# Altium schematic sheet STM32_microcontroller_power.SchDoc: STM32_microcontroller_power
size A4; Date: Not used; ApprovedBy: Not used; CheckedBy: Not used; Author: Not used; CompanyName: STMicroelectronics; DrawnBy: Not used; Engineer: Not used; Organization: Not used; Address1: Not used; Address2: Not used; Address3: Not used; Address4: Not used; DocumentNumber: 4; Revision: Not used; SheetNumber: 4; SheetTotal: 9; CurrentTime: Not used; CurrentDate: Not used; Time: Not used; DocumentFullPathAndName: Not used; DocumentName: Not used; ModifiedDate: Not used; ImagePath: Not used; ProjectName: Not used; Application_BuildNumber: Not used
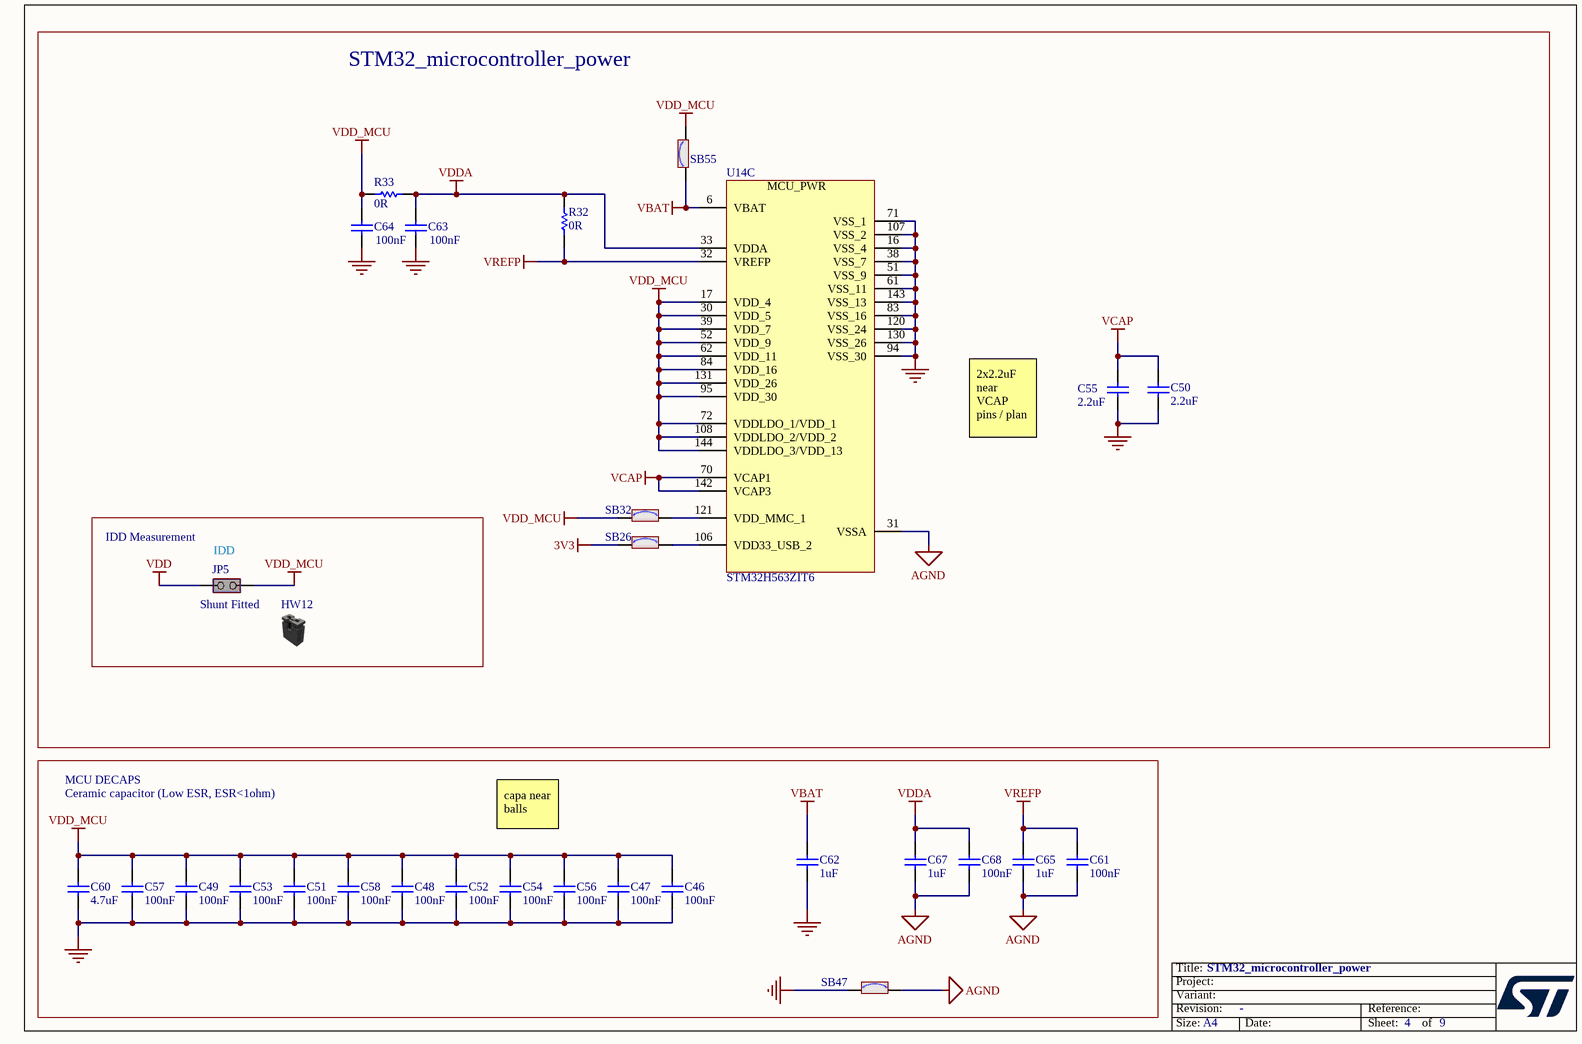
[diagram p0: STM32_microcontroller_power.SchDoc]

## Parts
C46  value 100nF  [C0402]  (hidden comment: Capacitor)
C47  value 100nF  [C0402]  (hidden comment: Capacitor)
C48  value 100nF  [C0402]  (hidden comment: Capacitor)
C49  value 100nF  [C0402]  (hidden comment: Capacitor)
C50  value 2.2uF  [C0603]  (hidden comment: Capacitor)
C51  value 100nF  [C0402]  (hidden comment: Capacitor)
C52  value 100nF  [C0402]  (hidden comment: Capacitor)
C53  value 100nF  [C0402]  (hidden comment: Capacitor)
C54  value 100nF  [C0402]  (hidden comment: Capacitor)
C55  value 2.2uF  [C0603]  (hidden comment: Capacitor)
C56  value 100nF  [C0402]  (hidden comment: Capacitor)
C57  value 100nF  [C0402]  (hidden comment: Capacitor)
C58  value 100nF  [C0402]  (hidden comment: Capacitor)
C60  value 4.7uF  [C0603_H0P8]  (hidden comment: Capacitor)
C61  value 100nF  [C0402]  (hidden comment: Capacitor)
C62  value 1uF  [C0603]  (hidden comment: Capacitor)
C63  value 100nF  [C0402]  (hidden comment: Capacitor)
C64  value 100nF  [C0402]  (hidden comment: Capacitor)
C65  value 1uF  [C0603]  (hidden comment: Capacitor)
C67  value 1uF  [C0603]  (hidden comment: Capacitor)
C68  value 100nF  [C0402]  (hidden comment: Capacitor)
HW12  Shunt Black 2.54mm  (value not drawn)  (mechanical)
JP5  value Shunt Fitted  [CON_SAMTEC_TSW-102-07-G-S]  (hidden comment: Jumper_Header 2x1 Fitted)
R32  value 0R  [R0603]  (hidden comment: Resistor)
R33  value 0R  [R0603]  (hidden comment: Resistor)
SB26  SB_ON  [SOLDER-BRIDGE_R0402-0R]  (value not drawn)
SB32  SB_ON  [SOLDER-BRIDGE_R0603-0R]  (value not drawn)
SB47  SB_ON  [SOLDER-BRIDGE_R0603-0R]  (value not drawn)
SB55  SB_ON  [SOLDER-BRIDGE_R0402-0R]  (value not drawn)
U14  STM32H563ZIT6  [ICC_LQFP144_20X20_P050_SOCKET_YAMAICHI_IC149-144-145-B5_NM]  (part C of 3)

## Blocks framed on the sheet
STM32_microcontroller_power: C50 C55 C63 C64 HW12 JP5 R32 R33 SB26 SB32 SB55 U14

## Nets
3V3: SB26.1
AGND: C61.1 C65.2 C67.2 C68.1 SB47.2 U14.31(VSSA)
GND: C46.1 C47.1 C48.1 C49.1 C50.1 C51.1 C52.1 C53.1 C54.1 C55.1 C56.1 C57.1 C58.1 C60.1 C62.1 C63.2 C64.2 SB47.1 U14.16(VSS_4) U14.38(VSS_7) U14.51(VSS_9) U14.61(VSS_11) U14.71(VSS_1) U14.83(VSS_16) U14.94(VSS_30) U14.107(VSS_2) U14.120(VSS_24) U14.130(VSS_26) U14.143(VSS_13)
VBAT: C62.2 SB55.1 U14.6(VBAT)
VCAP: C50.2 C55.2 U14.70(VCAP1) U14.142(VCAP3)
VDD: JP5.1(COMMON)
VDD_MCU: C46.2 C47.2 C48.2 C49.2 C51.2 C52.2 C53.2 C54.2 C56.2 C57.2 C58.2 C60.2 C64.1 JP5.2(NO) R33.1 SB32.1 SB55.2 U14.17(VDD_4) U14.30(VDD_5) U14.39(VDD_7) U14.52(VDD_9) U14.62(VDD_11) U14.72(VDDLDO_1/VDD_1) U14.84(VDD_16) U14.95(VDD_30) U14.108(VDDLDO_2/VDD_2) U14.131(VDD_26) U14.144(VDDLDO_3/VDD_13)
VDDA: C63.1 C67.1 C68.2 R32.1 R33.2 U14.33(VDDA)
VREFP: C61.2 C65.1 R32.2 U14.32(VREFP)
NetSB26_2: SB26.2 U14.106(VDD33_USB_2)
NetSB32_2: SB32.2 U14.121(VDD_MMC_1)

## Notes on the sheet
- 2x2.2uF near VCAP pins / plan
- (near JP5) IDD Measurement
- (near JP5) IDD
- MCU DECAPS
- Ceramic capacitor (Low ESR, ESR<1ohm)
- capa near balls
- Title:
- Project:
- Size:
- Revision:
- Variant:
- A4
- -
- Date:
- Reference:
- Sheet:
- of
- (in symbol MCD-02359, part C) MCU_PWR

## Library data of the parts
C46-C49 C51-C54 C56-C58 C61 C68 = MCD-00006: Capacitor, MLCC, 100nF, 16V, X7R, +/-10%, 0402, T=0.5mm; Part_Preference: Recommended; Manufacturer: YAGEO; Manufacturer_Part_Number: CC0402KRX7R7BB104; Alternate_Manufacturer: MURATA; Alternate_Manufacturer_Part_Number: GCM155R71C104KA55D; Order_Code_RS: 616-9701; Internal_Part_Number: MCD-00006; Status: Released; Part_Type: Capacitor; Package: 0402; ComponentLink1URL: http://tunmcdsvn.tun.st.com/Component_Documentation_Library/Trunk/Capacitor/YAGEO_X7R_Series; Order_Code_Digikey: 311-1338-1-ND; Order_Code_Farnell: 9402047
C50 C55 = MCD-00012: Capacitor, MLCC, 2.2uF, 10V, X5R, 10%, 0603, T=0,8mm; Manufacturer_Part_Number: CC0603KRX5R6BB225; Manufacturer: YAGEO; Alternate_Manufacturer_Part_Number: C0603C225K8PACTU; Alternate_Manufacturer: KEMET; Provided_By: SUBCO; ECCN_US: EAR99; ECCN_EU: NEC; Internal_Part_Number: MCD-00012; Status: Released; Part_Type: Capacitor; Package: C0603; ComponentLink1Description: Datasheet; ComponentLink1URL: http://tunmcdsvn.tun.st.com/Component_Datasheet_Library/Trunk/Capacitors/Yageo_Multilayer_capacitor_X5R_series_100pF_to_100uF
C60 = MCD-03342: Capacitor, MLCC, 4.7uF, 10V, X5R, +/-20%, 0603, T=0.8mm; Part_Preference: Recommended; Manufacturer: YAGEO; Manufacturer_Part_Number: CC0603MRX5R6BB475; Component_Country_Of_Origin: China, Taiwan; ShowFields: YES; ID: 5458; Internal_Part_Number: MCD-03342; Status: Checked; Part_Type: Capacitor; Package: 0603; ComponentLink1URL: http://tunmcdsvn.tun.st.com/Component_Documentation_Library/Trunk/Capacitor/YAGEO_X5R_Series/; Order_Code_Digikey: 311-1820-2-ND; Order_Code_Farnell: 3369257; Order_Code_RS: N/A
C62 C65 C67 = MCD-00238: Capacitor, MLCC, 1uF, 6V3, X5R, 10%, 0603, T=0,8mm; Manufacturer_Part_Number: CC0603KRX5R5BB105; Manufacturer: YAGEO; Provided_By: SUBCO; ECCN_US: EAR99; ECCN_EU: NEC; Internal_Part_Number: MCD-00238; Status: Released; Part_Type: Capacitor; Package: C0603; ComponentLink1Description: Datasheet; ComponentLink1URL: http://tunmcdsvn.tun.st.com/Component_Datasheet_Library/Trunk/Capacitors/Yageo_Multilayer_capacitor_X5R_series_100pF_to_100uF
C63 C64 = MCD-00006: Capacitor, MLCC, 100nF, 16V, X7R, 10%, 0402, T=0.5mm; Manufacturer_Part_Number: CC0402KRX7R7BB104; Manufacturer: YAGEO; Alternate_Manufacturer_Part_Number: GCM155R71C104KA55D; Alternate_Manufacturer: MURATA; Provided_By: SUBCO; ECCN_US: EAR99; ECCN_EU: NEC; Internal_Part_Number: MCD-00006; ComponentLink1Description: Datasheet; Status: Released; Package: C0402; Part_Type: Capacitor; ComponentLink1URL: http://tunmcdsvn.tun.st.com/Component_Datasheet_Library/Trunk/Capacitors/Yageo_Multilayer_Capacitor_X7R_series_100pF_to_22uF
HW12 = MCD-00043: SHUNT 2.54mm BLACK; Manufacturer_Part_Number: SNT-100-BK-G; Manufacturer: SAMTEC; Part_Type: Mechanical; Alternate_Manufacturer_Part_Number: 316102S111A; Alternate_Manufacturer: JIUBABA; Provided_By: SUBCO; Value: SNT-100-BK-G; Internal_Part_Number: MCD-00043; ComponentLink1Description: Datasheet; Status: Released; ComponentLink1URL: http://tunmcdsvn.tun.st.com/Component_Datasheet_Library/Trunk/Connectors/Samtec_Shunt_Jumper_SNT100; ECCN_US: n/a; ECCN_EU: n/a
JP5 = MCD-00683: Header, 2x1, 2,54mm, VR, TH, Height 5.84mm/2.54mm - Shunt Fitted by default; Part_Type: Connector; Manufacturer_Part_Number: TSW-102-07-x-S; Manufacturer: SAMTEC; Alternate_Manufacturer_Part_Number: 313102S111116; Alternate_Manufacturer: LIANYI; Provided_By: SUBCO; Internal_Part_Number: MCD-00683; Status: Released; ComponentLink1Description: Datasheet; ComponentLink1URL: http://tunmcdsvn.tun.st.com/Component_Datasheet_Library/Trunk/Connectors/Samtec_TSW-HTSW-series; ECCN_US: n/a; ECCN_EU: n/a
R32 R33 = MCD-00056: Resistor,0R,0603,5%,1/10W; Manufacturer_Part_Number: RC0603JR-070RL; Manufacturer: YAGEO; Provided_By: SUBCO; ECCN_US: EAR99; ECCN_EU: NEC; Internal_Part_Number: MCD-00056; ComponentLink1Description: Datasheet; Status: Released; Part_Type: Resistor; ComponentLink1URL: http://tunmcdsvn.tun.st.com/Component_Datasheet_Library/Trunk/Resistors/Yageo_Resistor_RC0603-series; Package: R0603
SB26 SB55 = MCD-01618: Solder Bridge 0402 ON; Part_Type: Mechanical; Manufacturer_Part_Number: RC0402JR-070RL; Manufacturer: YAGEO; Provided_By: SUBCO; Internal_Part_Number: MCD-01618; Status: Footprint available; Package: SB0402; ComponentLink1Description: Datasheet; ComponentLink1URL: http://tunmcdsvn.tun.st.com/Component_Datasheet_Library/Trunk/Resistors/Yageo_Resistor_RC0402-series; ECCN_US: n/a; ECCN_EU: n/a
SB32 SB47 = MCD-00071: Solder Bridge ON; Part_Type: Mechanical; Manufacturer_Part_Number: RC0603JR-070RL; Manufacturer: YAGEO; Provided_By: SUBCO; Internal_Part_Number: MCD-00071; Status: Released; ComponentLink1Description: Datasheet; Package: SB0603; ComponentLink1URL: http://tunmcdsvn.tun.st.com/Component_Datasheet_Library/Trunk/Resistors/Yageo_Resistor_RC0603-series; ECCN_US: n/a; ECCN_EU: n/a
U14 = MCD-02359: STM32H563ZIT6, LQFP144 package, 20x20; Part_Type: IC; Manufacturer: STMICROELECTRONICS; Part_Preference: Recommended; Internal_Part_Number: MCD-02359; Status: New; Manufacturer_Part_Number: STM32H563ZIT6; Package: LQFP144; ComponentLink1Description: Datasheet; ComponentLink1URL: http://tunmcdsvn.tun.st.com/Component_Datasheet_Library/Trunk/IC/STM_STM32L552ZET6QU; Value: STM32H563ZIT6